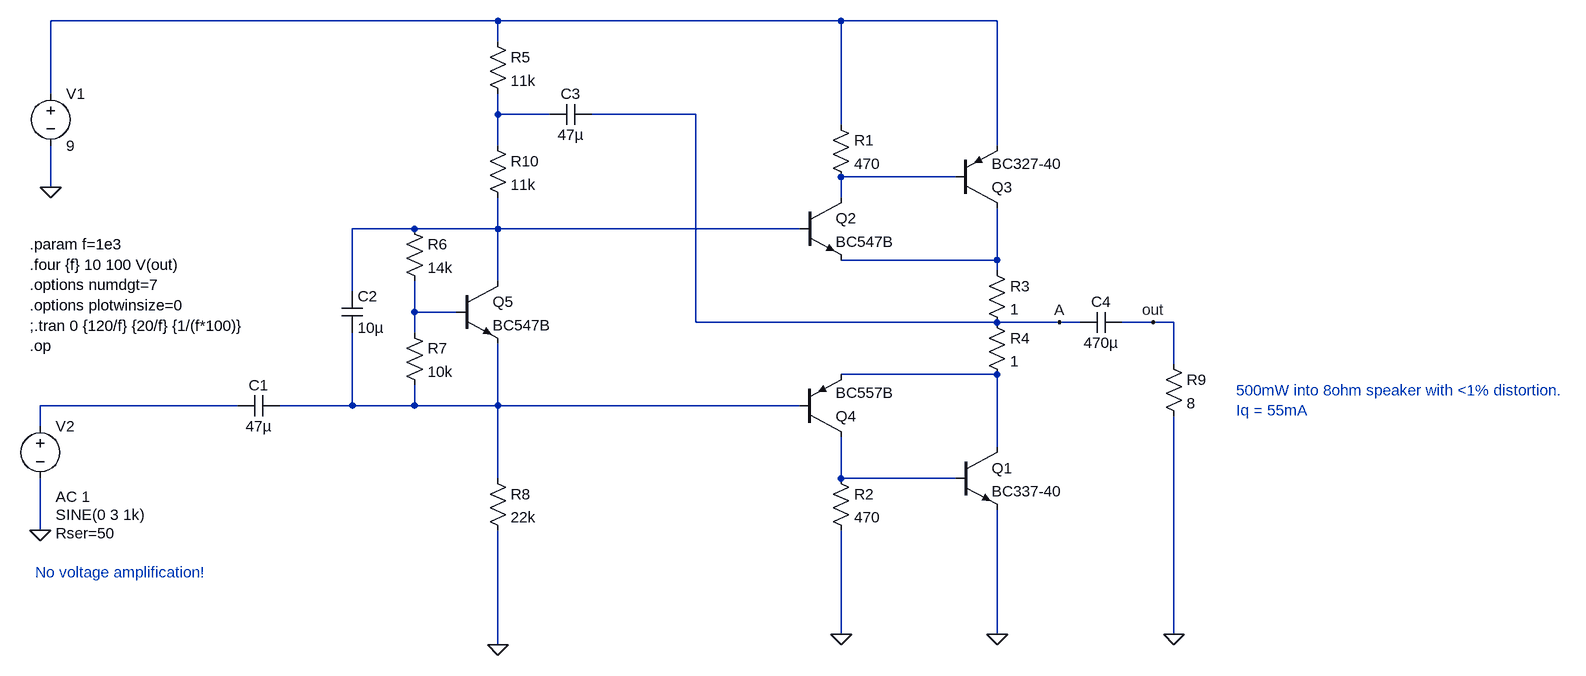
[diagram p0: schematic AoE.asc]
AoE.asc, the LTspice schematic file:
Version 4
SHEET 1 2568 680
WIRE 864 -368 176 -368
WIRE 1392 -368 864 -368
WIRE 1632 -368 1392 -368
WIRE 864 -336 864 -368
WIRE 176 -256 176 -368
WIRE 864 -224 864 -256
WIRE 944 -224 864 -224
WIRE 1168 -224 1008 -224
WIRE 1392 -208 1392 -368
WIRE 864 -176 864 -224
WIRE 1632 -176 1632 -368
WIRE 1568 -128 1392 -128
WIRE 176 -112 176 -176
WIRE 1392 -96 1392 -128
WIRE 736 -48 640 -48
WIRE 864 -48 864 -96
WIRE 864 -48 736 -48
WIRE 1328 -48 864 -48
WIRE 1632 0 1632 -80
WIRE 1632 0 1392 0
WIRE 1632 16 1632 0
WIRE 864 32 864 -48
WIRE 640 48 640 -48
WIRE 736 80 736 32
WIRE 800 80 736 80
WIRE 1168 96 1168 -224
WIRE 1632 96 1168 96
WIRE 1728 96 1632 96
WIRE 1760 96 1728 96
WIRE 1872 96 1824 96
WIRE 1904 96 1872 96
WIRE 736 112 736 80
WIRE 1904 160 1904 96
WIRE 1632 176 1392 176
WIRE 464 224 160 224
WIRE 640 224 640 112
WIRE 640 224 528 224
WIRE 736 224 736 192
WIRE 736 224 640 224
WIRE 864 224 864 128
WIRE 864 224 736 224
WIRE 1328 224 864 224
WIRE 160 256 160 224
WIRE 1632 288 1632 176
WIRE 864 336 864 224
WIRE 1392 336 1392 272
WIRE 1568 336 1392 336
WIRE 160 416 160 336
WIRE 1392 576 1392 416
WIRE 1632 576 1632 384
WIRE 1904 576 1904 240
WIRE 864 592 864 416
FLAG 176 -112 0
FLAG 160 416 0
FLAG 1632 576 0
FLAG 1392 576 0
FLAG 1904 576 0
FLAG 1872 96 out
FLAG 1728 96 A
FLAG 864 592 0
SYMBOL npn 1568 288 R0
SYMATTR InstName Q1
SYMATTR Value BC337-40
SYMBOL pnp 1568 -80 M180
SYMATTR InstName Q3
SYMATTR Value BC327-40
SYMBOL voltage 176 -272 R0
SYMATTR InstName V1
SYMATTR Value 9
SYMBOL cap 528 208 R90
WINDOW 0 0 32 VBottom 2
WINDOW 3 32 32 VTop 2
SYMATTR InstName C1
SYMATTR Value 47µ
SYMBOL voltage 160 240 R0
WINDOW 3 24 152 Left 2
WINDOW 123 24 124 Left 2
WINDOW 39 24 180 Left 2
SYMATTR Value SINE(0 3 1k)
SYMATTR Value2 AC 1
SYMATTR SpiceLine Rser=50
SYMATTR InstName V2
SYMBOL res 1376 -224 R0
SYMATTR InstName R1
SYMATTR Value 470
SYMBOL res 1376 320 R0
SYMATTR InstName R2
SYMATTR Value 470
SYMBOL npn 1328 -96 R0
SYMATTR InstName Q2
SYMATTR Value BC547B
SYMBOL pnp 1328 272 M180
SYMATTR InstName Q4
SYMATTR Value BC557B
SYMBOL res 1616 0 R0
SYMATTR InstName R3
SYMATTR Value 1
SYMBOL res 1616 80 R0
SYMATTR InstName R4
SYMATTR Value 1
SYMBOL res 848 -352 R0
SYMATTR InstName R5
SYMATTR Value 11k
SYMBOL npn 800 32 R0
SYMATTR InstName Q5
SYMATTR Value BC547B
SYMBOL res 720 -64 R0
SYMATTR InstName R6
SYMATTR Value 14k
SYMBOL res 720 96 R0
SYMATTR InstName R7
SYMATTR Value 10k
SYMBOL cap 624 48 R0
SYMATTR InstName C2
SYMATTR Value 10µ
SYMBOL cap 1824 80 R90
WINDOW 0 0 32 VBottom 2
WINDOW 3 32 32 VTop 2
SYMATTR InstName C4
SYMATTR Value 470µ
SYMBOL res 1888 144 R0
SYMATTR InstName R9
SYMATTR Value 8
SYMBOL res 848 -192 R0
SYMATTR InstName R10
SYMATTR Value 11k
SYMBOL cap 1008 -240 R90
WINDOW 0 0 32 VBottom 2
WINDOW 3 32 32 VTop 2
SYMATTR InstName C3
SYMATTR Value 47µ
SYMBOL res 848 320 R0
SYMATTR InstName R8
SYMATTR Value 22k
TEXT 144 -24 Left 2 !.param f=1e3\n.four {f} 10 100 V(out)\n.options numdgt=7\n.options plotwinsize=0\n;.tran 0 {120/f} {20/f} {1/(f*100)}\n.op
TEXT 2000 200 Left 2 ;500mW into 8ohm speaker with <1% distortion.\nIq = 55mA
TEXT 152 480 Left 2 ;No voltage amplification!

The netlist it stands for:
* AoE.asc
Q1 N007 N010 0 0 BC337-40
Q3 N005 N003 N001 0 BC327-40
V1 N001 0 9
C1 N009 N008 47µ
V2 N008 0 SINE(0 3 1k) AC 1 Rser=50
R1 N001 N003 470
R2 N010 0 470
Q2 N003 N004 N005 0 BC547B
Q4 N010 N009 N007 0 BC557B
R3 N005 A 1
R4 A N007 1
R5 N001 N002 11k
Q5 N004 N006 N009 0 BC547B
R6 N004 N006 14k
R7 N006 N009 10k
C2 N004 N009 10µ
C4 out A 470µ
R9 out 0 8
R10 N002 N004 11k
C3 A N002 47µ
R8 N009 0 22k
.model NPN NPN
.model PNP PNP
.lib standard.bjt
.param f=1e3
.four {f} 10 100 V(out)
.options numdgt=7
.options plotwinsize=0
;.tran 0 {120/f} {20/f} {1/(f*100)}
.op
* 500mW into 8ohm speaker with <1% distortion.
* Iq = 55mA
* No voltage amplification!
.backanno
.end